# Altium schematic sheet PowerSupply.SchDoc
size A3; SheetNumber: 1; SheetTotal: 4
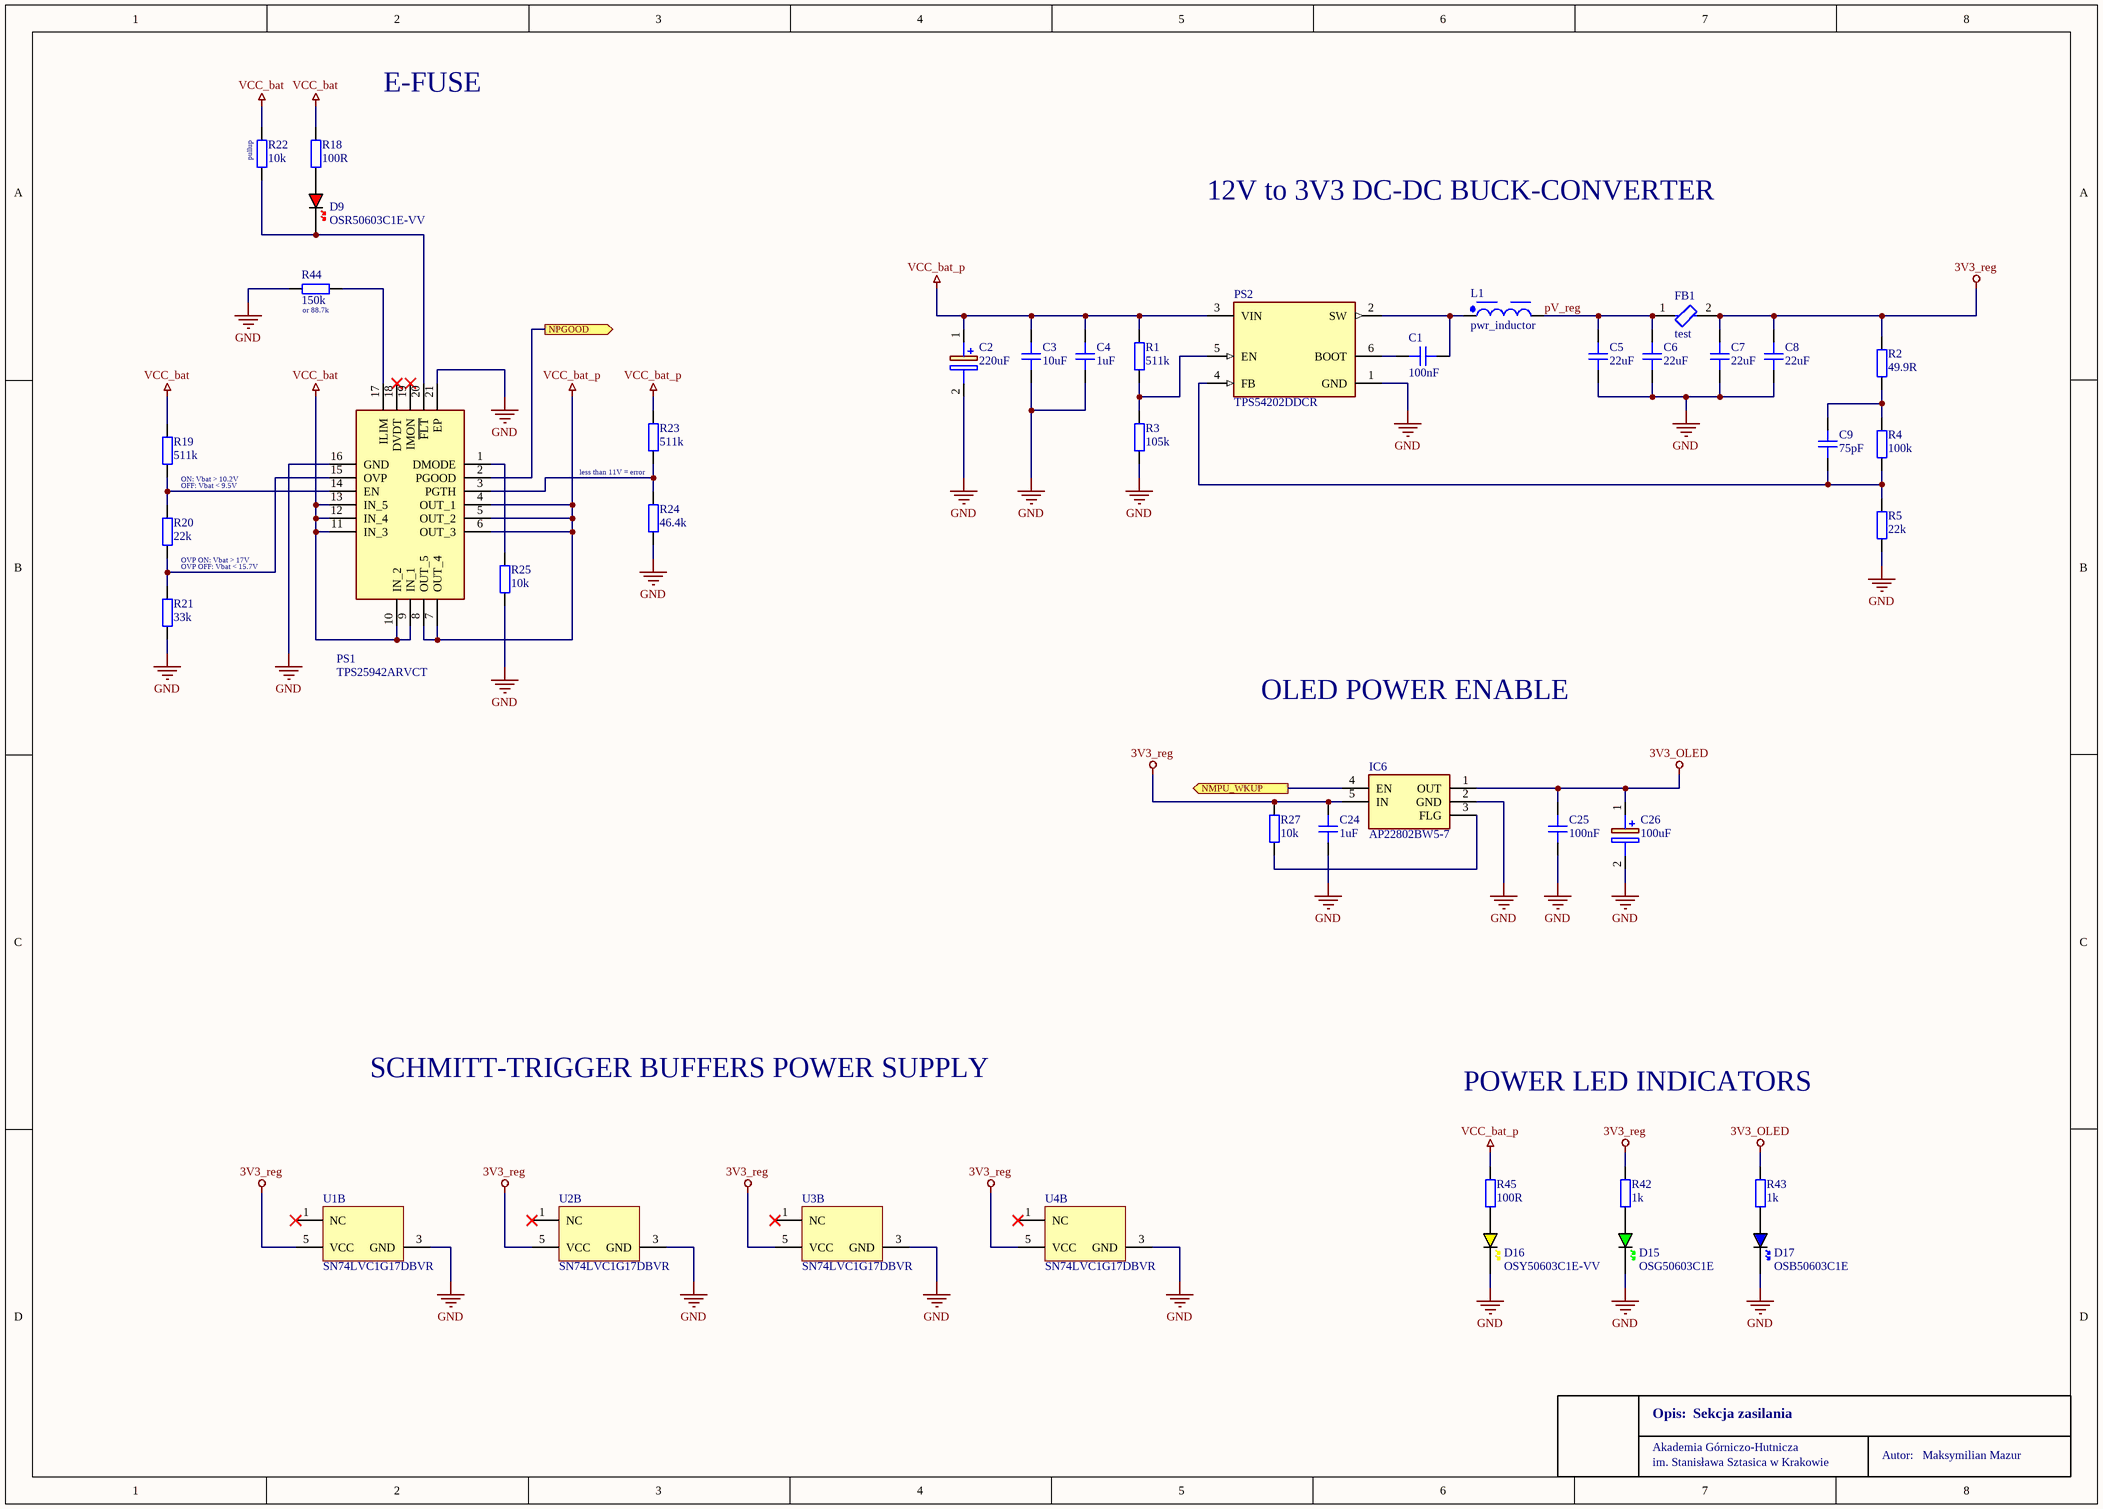
[diagram p0: PowerSupply.SchDoc]

## Parts
C1  100nF  [CAP_0603]
C2  220uF  [CAPAE660X810N]
C3  10uF  [CAP_1206]
C4  1uF  [CAP_0603]
C5  22uF  [CAP_0603]
C6  22uF  [CAP_0603]
C7  22uF  [CAP_0603]
C8  22uF  [CAP_0603]
C9  75pF  [CAP_0603]
C24  1uF  [CAP_0603]
C25  100nF  [CAP_0603]
C26  100uF  [CAPPM3528X210N]
D9  OSR50603C1E-VV  [LED_0603_RED]
D15  OSG50603C1E  [LED_0603_GREEN]
D16  OSY50603C1E-VV  [LED_0603_YELLOW]
D17  OSB50603C1E  [LED_0603_BLUE]
FB1  test  [FP-BLM18-0_15-t0_8-IPC_A]
IC6  AP22802BW5-7  [SOT95P285X140-5N]
L1  pwr_inductor  [WE-PD_7345]
PS1  TPS25942ARVCT  [QFN50P300X400X80-21N]
PS2  TPS54202DDCR  [FP-DDC0006A-IPC_B]
R1  511k  [RES_0603]
R2  49.9R  [RES_0603]
R3  105k  [RES_0603]
R4  100k  [RES_0603]
R5  22k  [RES_0603]
R18  100R  [RES_0603]
R19  511k  [RES_0603]
R20  22k  [RES_0603]
R21  33k  [RES_0603]
R22  10k  [RES_0603]
R23  511k  [RES_0603]
R24  46.4k  [RES_0603]
R25  10k  [RES_0603]
R27  10k  [RES_0603]
R42  1k  [RES_0603]
R43  1k  [RES_0603]
R44  150k  [RES_0603]
R45  100R  [RES_0603]
U1  SN74LVC1G17DBVR  [DBV0005A_L]  (part B of 2)
U2  SN74LVC1G17DBVR  [DBV0005A_L]  (part B of 2)
U3  SN74LVC1G17DBVR  [DBV0005A_L]  (part B of 2)
U4  SN74LVC1G17DBVR  [DBV0005A_L]  (part B of 2)

## Ports
NMPU_WKUP (out, see Buffers[3C], MPU[5C]), NPGOOD (out, see MPU[5C])

## Nets
3V3_OLED: C25.2 C26.1(+) IC6.1(OUT) R43.2
3V3_reg: C7.2 C8.2 C24.2 FB1.2 IC6.5(IN) R2.2 R27.2 R42.2 U1.5(VCC) U2.5(VCC) U3.5(VCC) U4.5(VCC)
GND: C2.2(-) C3.1 C4.1 C5.1 C6.1 C7.1 C8.1 C24.1 C25.1 C26.2(-) D15.K D16.K D17.K IC6.2(GND) PS1.16(GND) PS1.21(EP) PS2.1(GND) R3.1 R5.2 R21.1 R24.1 R25.1 R44.2 U1.3(GND) U2.3(GND) U3.3(GND) U4.3(GND)
VCC_bat: PS1.9(IN_1) PS1.10(IN_2) PS1.11(IN_3) PS1.12(IN_4) PS1.13(IN_5) R18.2 R19.2 R22.2
VCC_bat_p: C2.1(+) C3.2 C4.2 PS1.4(OUT_1) PS1.5(OUT_2) PS1.6(OUT_3) PS1.7(OUT_4) PS1.8(OUT_5) PS2.3(VIN) R1.2 R23.2 R45.2
NMPU_WKUP: IC6.4(EN) ; port NMPU_WKUP
NPGOOD: PS1.2(PGOOD) ; port NPGOOD
pV_reg: C5.2 C6.2 FB1.1 L1.2
NetC1_1: C1.1 L1.1 PS2.2(SW)
NetC1_2: C1.2 PS2.6(BOOT)
NetC9_1: C9.1 PS2.4(FB) R4.1 R5.1
NetC9_2: C9.2 R2.1 R4.2
NetD9_A: D9.A R18.1
NetD9_K: D9.K PS1.20(~{FLT}) R22.1
NetD15_A: D15.A R42.1
NetD16_A: D16.A R45.1
NetD17_A: D17.A R43.1
NetIC6_3: IC6.3(FLG) R27.1
NetPS1_1: PS1.1(DMODE) R25.2
NetPS1_3: PS1.3(PGTH) R23.1 R24.2
NetPS1_14: PS1.14(EN) R19.1 R20.2
NetPS1_15: PS1.15(OVP) R20.1 R21.2
NetPS1_17: PS1.17(ILIM) R44.1
NetPS2_5: PS2.5(EN) R1.1 R3.2

Not connected (* = marked no-connect by the designer): PS1 18(DVDT)* 19(IMON)*; U1 1(NC)*; U2 1(NC)*; U3 1(NC)*; U4 1(NC)*

## Notes on the sheet
- E-FUSE
- (near R22) pullup
- 12V to 3V3 DC-DC BUCK-CONVERTER
- (near R44) or 88.7k
- (near R19) ON: Vbat > 10.2V
- OFF: Vbat < 9.5V
- less than 11V = error
- (near R20) OVP ON: Vbat > 17V
- OVP OFF: Vbat < 15.7V
- OLED POWER ENABLE
- SCHMITT-TRIGGER BUFFERS POWER SUPPLY
- POWER LED INDICATORS
- Akademia Górniczo-Hutnicza
- Opis:
- Sekcja zasilania
- Autor:
- Maksymilian Mazur
- im. Stanisława Sztasica w Krakowie

## Library data of the parts
C1 C5-C8 = CAP_0603: Capacitor SMD 0603 / X7R / LOW ESR; Manufacturer: *; Manufacturer Part Number: *; Distributor Link: *; LCSC: *; Rating: *; Dielectric: *
C2 = SC1C227M6L07KVR: Capacitor Polarised / 220uF 16V / SC1C227M6L07KVR; Manufacturer_Name: SAMWHA; Datasheet Link: https://octopart.com/datasheet/sc1c227m6l07kvr-samwha-30812620; Height: 8.1mm; Manufacturer_Part_Number: SC1C227M6L07KVR
C3 = CAP_1206: Capacitor SMD 1206 / 25V; Manufacturer: *; Manufacturer Part Number: *; Distributor Link: *; LCSC: *; Rating: *; Dielectric: *
C4 = CAP_0603: Capacitor SMD 0603 / 25V; Manufacturer: *; Manufacturer Part Number: *; Distributor Link: *; LCSC: *; Rating: *; Dielectric: *
C9 C24 C25 = CAP_0603: Capacitor SMD 0603; Manufacturer: *; Manufacturer Part Number: *; Distributor Link: *; LCSC: *; Rating: *; Dielectric: *
C26 = TAJB107M010RNJ: Kyocera AVX / TAJB107M010RNJ; Datasheet Link: http://datasheets.avx.com/TAJ.pdf; Height: 2.1mm; Manufacturer_Name: Kyocera AVX; Manufacturer_Part_Number: TAJB107M010RNJ; Mouser Part Number: 581-TAJB107M010R; Mouser Price/Stock: https://www.mouser.co.uk/ProductDetail/KYOCERA-AVX/TAJB107M010RNJ?qs=fdqkYiOtZpcLl77pdaUmPA%3D%3D; Arrow Part Number: TAJB107M010RNJ; Arrow Price/Stock: https://www.arrow.com/en/products/tajb107m010rnj/avx?utm_currency=USD&region=europe
D9 = LED_0603_RED: LED 0603 RED SMD / Model: OSR50603C1E
D15 = LED_0603_GREEN: LED 0603 GREEN SMD / OSG50603C1E
D16 = LED_0603_YELLOW: LED 0603 YELLOW SMD / OSY50603C1E-VV
D17 = LED_0603_BLUE: LED 0603 BLUE SMD
FB1 = CMP-0686-00557-7: Chip Ferrite Bead, 0603 / For testing purpose; Impedance: 120R; Frequency: 100MHz; Number of Circuits: 1; Max Current Rating: 2A; Shielding: Unshielded; Material: Steel; DC Resistance (DCR): 50mR; Tolerance: 25%; Case Code (Imperial): 0603; RoHS Compliant: Yes; Number of Pins: 2; Min Operating Temperature: -55°C; Case Code (Metric): 1608; Length: 1.6mm; Test Frequency: 100MHz; Max Operating Temperature: 125°C; Packaging: Tape and Reel; Termination: SMD/SMT; Lead Free: Lead Free; Max DC Current: 2A; Case/Package: 0603; Height: 0.8mm; Current Rating: 2A; Radiation Hardening: No; Core Material: Ferrite; DC Current: 2A; REACH SVHC: No SVHC; Package Quantity: 1; Depth: 0.8mm; Number of Lines: 1; Width: 0.8mm
IC6 = AP22802BW5-7: Integrated Circuit; Manufacturer_Name: Diodes Incorporated; Datasheet Link: https://www.diodes.com//assets/Datasheets/products_inactive_data/AP22802.pdf; Height: 1.4mm; Manufacturer_Part_Number: AP22802BW5-7; Mouser Part Number: 621-AP22802BW5-7; Mouser Price/Stock: https://www.mouser.co.uk/ProductDetail/Diodes-Incorporated/AP22802BW5-7?qs=4WD8WRWcnWvdREmNWulNnQ%3D%3D; Arrow Part Number: AP22802BW5-7; Arrow Price/Stock: https://www.arrow.com/en/products/ap22802bw5-7/diodes-incorporated?utm_currency=USD&region=asia
L1 = CMP-0227-00155-2: 15uF, 2.7A  HPI0630-150; NexarPartId: 31136509; Self Resonant Frequency: 9.5MHz; Inductance: 15µH; Tolerance: 20%; DC Resistance (DCR): 110mΩ; Shielding: Shielded; Ambient Temperature Range Low: -40°C; Depth: 7.3mm; Max Operating Temperature: 125°C; Length: 7.3mm; Max DC Current: 2.7A; Height: 4.5mm; Current Rating: 2.7A; Width: 7.3mm; Number of Pins: 2; Min Operating Temperature: -40°C; Ambient Temperature Range High: 85°C; RoHS: Compliant; Packaging: Tape & Reel
PS1 = TPS25942ARVCT: Power Supply; Manufacturer_Name: Texas Instruments; Datasheet Link: https://www.arrow.com/en/products/tps25942arvct/texas-instruments; Height: 0.8mm; Manufacturer_Part_Number: TPS25942ARVCT; Mouser Part Number: 595-TPS25942ARVCT; Mouser Price/Stock: https://www.mouser.co.uk/ProductDetail/Texas-Instruments/TPS25942ARVCT?qs=1MXlzafEN38%2FhNIOFl0fzQ%3D%3D; Arrow Part Number: TPS25942ARVCT; Arrow Price/Stock: https://www.arrow.com/en/products/tps25942arvct/texas-instruments?utm_currency=USD&region=nac
PS2 = CMP-04918-000439-1: IC REG BUCK ADJ 2A TSOT23-6; Switching Frequency: 500kHz; Quiescent Current: 40uA; Max Output Voltage: 28V; Output Configuration: Positive; Min Output Voltage: 596mV; Min Input Voltage: 4.5V; Synchronous Rectifier: Yes; Output Type: Adjustable; Number of Outputs: 1; Packaging: Tape and Reel; Case/Package: SOT-23-6; RoHS Compliant: Yes; Max Input Voltage: 28V; Max Operating Temperature: 125°C; Min Operating Temperature: -40°C; Output Current: 2A; Lead Free: Lead Free; Mount: Surface Mount; ComponentLink1Description: datasheet; ComponentLink1URL: https://www.ti.com/lit/ds/symlink/tps54202.pdf
R1-R3 R18-R25 R27 R42-R45 = RES_0603: Resistor SMD 0603; Manufacturer: *; Manufacturer Part Number: *; Distributor Link: *; LCSC: *
R4 R5 = RES_0603: Resistor SMD 0603 / Tolerance 1%; Manufacturer: *; Manufacturer Part Number: *; Distributor Link: *; LCSC: *
U1-U4 = CMP-0859-00033-4: Single Schmitt-Trigger Buffer, DBV0005A, LARGE T&R; Manufacturer: Texas Instruments; Output Drive (IOL/IOH)(Max)(mA): 32/-32; Technology Family: LVC; ICC @ Nom Voltage(Max)(mA): 0.01; VCC(Min)(V): 1.65; F @ Nom Voltage(Max)(Mhz): 150; Schmitt Trigger: Yes; Voltage(Nom)(V): 1.8,2.5,3.3,5; 3-State Output: No; Bits(#): 1; VCC(Max)(V): 5.5; Input Type: CMOS/TTL; Logic: True; tpd @ Nom Voltage(Max)(ns): 11,6.5,5.5,5; Output Type: CMOS; Rating: Catalog; Sub-Family: Non-Inverting Buffer/Driver; PackageReference: DBV0005A; DatasheetVersion: SCES351V; Generic Part Number: SN74LVC1G17; Operating Temperature Range(C): -40 to 125,-40 to 85